# EAGLE schematic RobotArm (EAGLE 9.1.1)
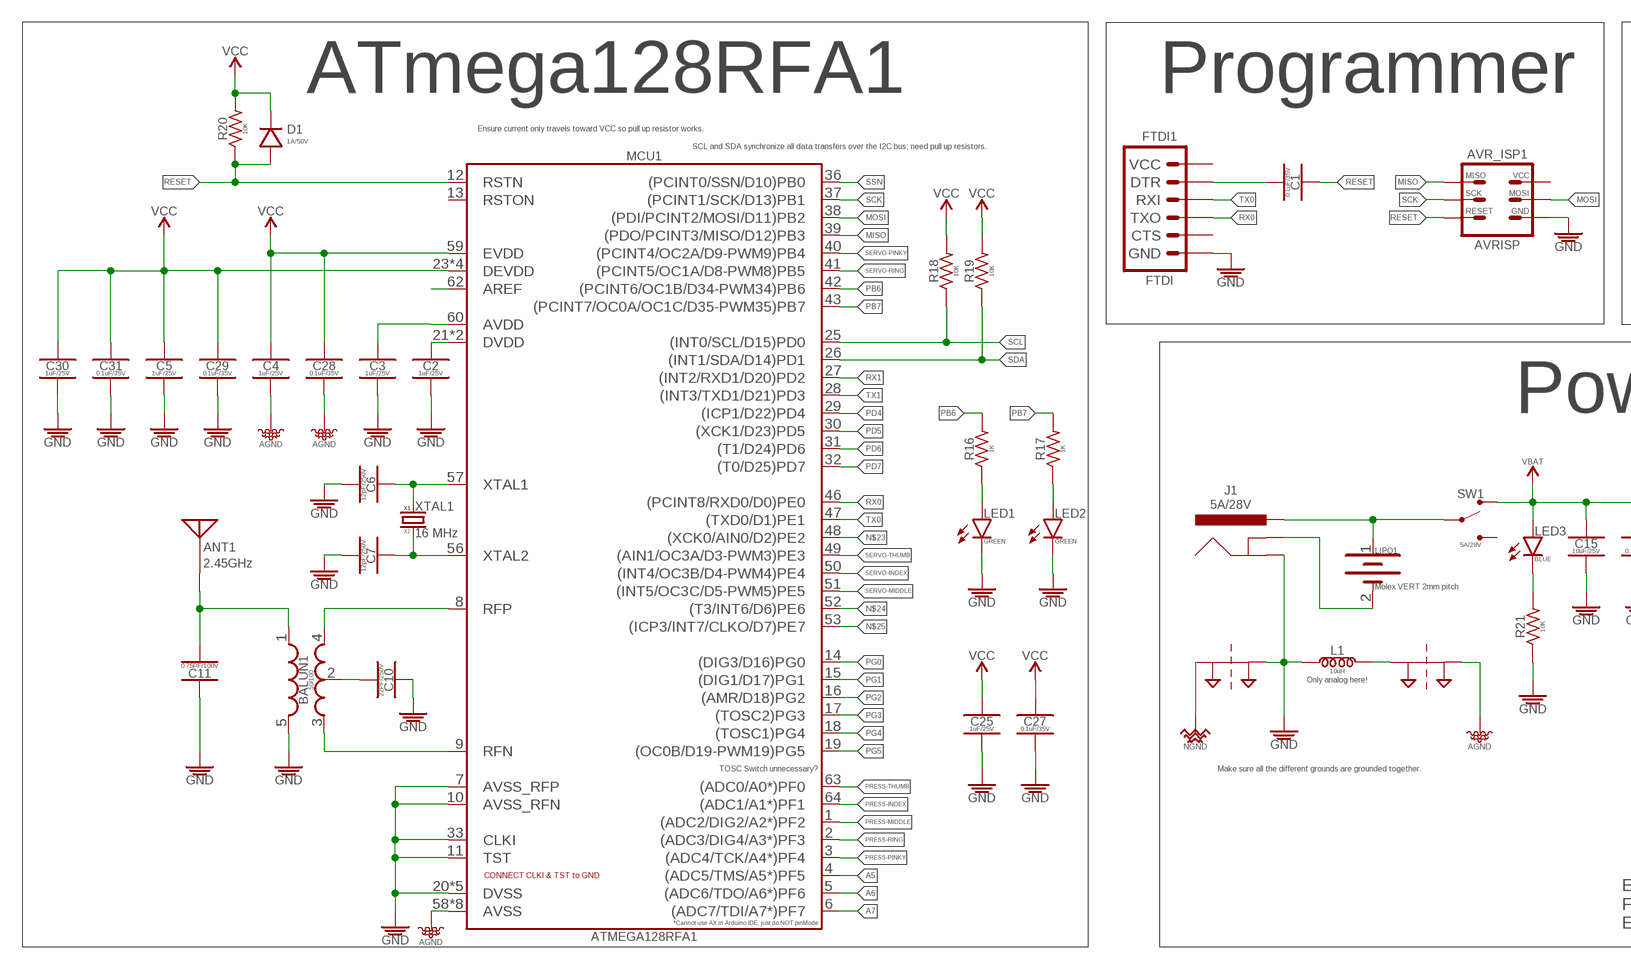
[diagram p0: schematic, sheet 1, part 1 of 2]
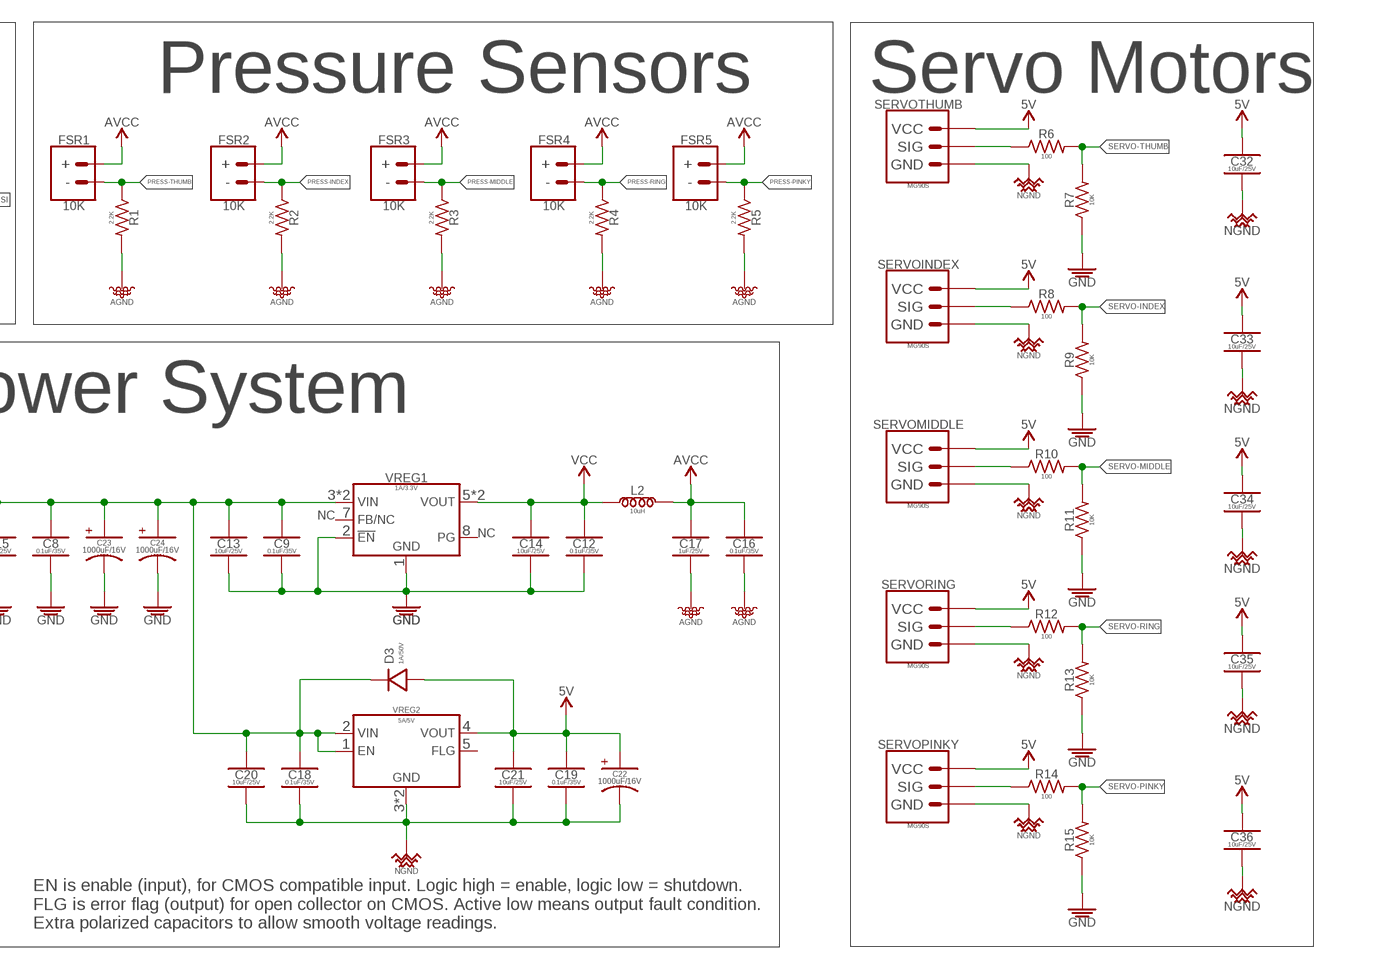
[diagram p1: schematic, sheet 1, part 2 of 2]

## Parts
ANT1  2.45GHz  ANTENNA_SMD_CHP-2.45GHZ-0.5DBI-3W  [ANTC6522X100]
AVR_ISP1  AVRISP  AVR_SPI_PRG_6_PTH_VERT-MALE  [2X3-NS]
BALUN1  50/100  BALUN_SMD-0805_UNBAL/BAL-50/100  [RESCAXE65P200X125X95-6]
C1  0.1uF/35V  0.1UF_SMD-0805_35V-10%  [CAPC2012X95_SMD-0805]
C2  1uF/25V  1UF_CER_SMD-0805_25V-10%  [CAPC2012X95_SMD-0805]
C3  1uF/25V  1UF_CER_SMD-0805_25V-10%  [CAPC2012X95_SMD-0805]
C4  1uF/25V  1UF_CER_SMD-0805_25V-10%  [CAPC2012X95_SMD-0805]
C5  1uF/25V  1UF_CER_SMD-0805_25V-10%  [CAPC2012X95_SMD-0805]
C6  12pF/250V  12PF_SMD-0805_250V-5%  [CAPC2012X95_SMD-0805]
C7  12pF/250V  12PF_SMD-0805_250V-5%  [CAPC2012X95_SMD-0805]
C8  0.1uF/35V  0.1UF_SMD-0805_35V-10%  [CAPC2012X95_SMD-0805]
C9  0.1uF/35V  0.1UF_SMD-0805_35V-10%  [CAPC2012X95_SMD-0805]
C10  22PF/250V  22PF_SMD-805_250V-5%  [_CER_SMD-805]
C11  0.75PF/100V  0.75PF_SMD-805_100V-33%  [_CER_SMD-805]
C12  0.1uF/35V  0.1UF_SMD-0805_35V-10%  [CAPC2012X95_SMD-0805]
C13  10uF/25V  10UF_CER_SMD-0805_25V-10%  [CAPC2012X95_SMD-0805]
C14  10uF/25V  10UF_CER_SMD-0805_25V-10%  [CAPC2012X95_SMD-0805]
C15  10uF/25V  10UF_CER_SMD-0805_25V-10%  [CAPC2012X95_SMD-0805]
C16  0.1uF/35V  0.1UF_SMD-0805_35V-10%  [CAPC2012X95_SMD-0805]
C17  1uF/25V  1UF_CER_SMD-0805_25V-10%  [CAPC2012X95_SMD-0805]
C18  0.1uF/35V  0.1UF_SMD-0805_35V-10%  [CAPC2012X95_SMD-0805]
C19  0.1uF/35V  0.1UF_SMD-0805_35V-10%  [CAPC2012X95_SMD-0805]
C20  10uF/25V  10UF_CER_SMD-0805_25V-10%  [CAPC2012X95_SMD-0805]
C21  10uF/25V  10UF_CER_SMD-0805_25V-10%  [CAPC2012X95_SMD-0805]
C22  1000uF/16V  1000UF-POLARIZED_PTH_16V-20%  [_AE_PTH_DIA8-LS3.5-H21.50]
C23  1000uF/16V  1000UF-POLARIZED_PTH_16V-20%  [_AE_PTH_DIA8-LS3.5-H21.50]
C24  1000uF/16V  1000UF-POLARIZED_PTH_16V-20%  [_AE_PTH_DIA8-LS3.5-H21.50]
C25  1uF/25V  1UF_CER_SMD-0805_25V-10%  [CAPC2012X95_SMD-0805]
C27  0.1uF/35V  0.1UF_SMD-0805_35V-10%  [CAPC2012X95_SMD-0805]
C28  0.1uF/35V  0.1UF_SMD-0805_35V-10%  [CAPC2012X95_SMD-0805]
C29  0.1uF/35V  0.1UF_SMD-0805_35V-10%  [CAPC2012X95_SMD-0805]
C30  1uF/25V  1UF_CER_SMD-0805_25V-10%  [CAPC2012X95_SMD-0805]
C31  0.1uF/35V  0.1UF_SMD-0805_35V-10%  [CAPC2012X95_SMD-0805]
C32  10uF/25V  10UF_CER_SMD-0805_25V-10%  [CAPC2012X95_SMD-0805]
C33  10uF/25V  10UF_CER_SMD-0805_25V-10%  [CAPC2012X95_SMD-0805]
C34  10uF/25V  10UF_CER_SMD-0805_25V-10%  [CAPC2012X95_SMD-0805]
C35  10uF/25V  10UF_CER_SMD-0805_25V-10%  [CAPC2012X95_SMD-0805]
C36  10uF/25V  10UF_CER_SMD-0805_25V-10%  [CAPC2012X95_SMD-0805]
D1  1A/50V  DIODE_GENERAL-PURPOSE_SMD_GP_1A-50V  [SODFL3516X170]
D3  1A/50V  DIODE_GENERAL-PURPOSE_SMD_GP_1A-50V  [SODFL3516X170]
FSR1  10K  FORCE-SENSITIVE-RESISTOR_SENSOR_FSR-5MM_0530470210_VERT-MALE_PITCH-1.25MM  [_MOLEX-0530470210_VERT_PITCH-1.25MM]
FSR2  10K  FORCE-SENSITIVE-RESISTOR_SENSOR_FSR-5MM_0530470210_VERT-MALE_PITCH-1.25MM  [_MOLEX-0530470210_VERT_PITCH-1.25MM]
FSR3  10K  FORCE-SENSITIVE-RESISTOR_SENSOR_FSR-5MM_0530470210_VERT-MALE_PITCH-1.25MM  [_MOLEX-0530470210_VERT_PITCH-1.25MM]
FSR4  10K  FORCE-SENSITIVE-RESISTOR_SENSOR_FSR-5MM_0530470210_VERT-MALE_PITCH-1.25MM  [_MOLEX-0530470210_VERT_PITCH-1.25MM]
FSR5  10K  FORCE-SENSITIVE-RESISTOR_SENSOR_FSR-5MM_0530470210_VERT-MALE_PITCH-1.25MM  [_MOLEX-0530470210_VERT_PITCH-1.25MM]
FTDI1  FTDI  FTDI_PTH_RA-MALE  [FTDI_BASIC-6PIN-MALE-RA]
J1  5A/28V  POWER_JACK-BARREL_ID2.1MM-OD5.5MM_PTH_ID2.1MM-OD5.5MM  [POWER_JACK_PTH_ID2.1MM-OD5.5MM]
L1  10uH  10UH_SMD-805_0.5A-0.65OHM-10%  [_SMD-805]
L2  10uH  10UH_SMD-805_0.5A-0.65OHM-10%  [_SMD-805]
LED1  GREEN  LED_SMD-0805_DISCRETE_GREEN_  [LEDC2012X120_LED-0805]
LED2  GREEN  LED_SMD-0805_DISCRETE_GREEN_  [LEDC2012X120_LED-0805]
LED3  BLUE  LED_SMD-0805_DISCRETE_BLUE  [LEDC2012X120_LED-0805]
LIPO1  Molex VERT 2mm pitch  1X02_MOLEX_89400_VERT-MALE_PITCH-2MM  [_MOLEX-89400_VERT_PITCH-2MM]
MCU1  ATMEGA128RFA1  ATMEGA128RFA1_VFQFN-64_EXPOSED-PAD  [QFN50P900X900X90-64]
NET_BRIDGE1  2PT_GND_TIE  [2PT_GND_TIE]
NET_BRIDGE2  2PT_GND_TIE  [2PT_GND_TIE]
R1  2.2K  2.2KΩ_SMD-0805_1/8W-5%  [RESC2012X60_SMD-0805]
R2  2.2K  2.2KΩ_SMD-0805_1/8W-5%  [RESC2012X60_SMD-0805]
R3  2.2K  2.2KΩ_SMD-0805_1/8W-5%  [RESC2012X60_SMD-0805]
R4  2.2K  2.2KΩ_SMD-0805_1/8W-5%  [RESC2012X60_SMD-0805]
R5  2.2K  2.2KΩ_SMD-0805_1/8W-5%  [RESC2012X60_SMD-0805]
R6  100  100Ω_SMD-0805_1/8W-5%  [RESC2012X60_SMD-0805]
R7  10K  10KΩ_SMD-0805_1/8W-5%  [RESC2012X60_SMD-0805]
R8  100  100Ω_SMD-0805_1/8W-5%  [RESC2012X60_SMD-0805]
R9  10K  10KΩ_SMD-0805_1/8W-5%  [RESC2012X60_SMD-0805]
R10  100  100Ω_SMD-0805_1/8W-5%  [RESC2012X60_SMD-0805]
R11  10K  10KΩ_SMD-0805_1/8W-5%  [RESC2012X60_SMD-0805]
R12  100  100Ω_SMD-0805_1/8W-5%  [RESC2012X60_SMD-0805]
R13  10K  10KΩ_SMD-0805_1/8W-5%  [RESC2012X60_SMD-0805]
R14  100  100Ω_SMD-0805_1/8W-5%  [RESC2012X60_SMD-0805]
R15  10K  10KΩ_SMD-0805_1/8W-5%  [RESC2012X60_SMD-0805]
R16  1K  1KΩ_SMD-0805_1/8W-5%  [RESC2012X60_SMD-0805]
R17  1K  1KΩ_SMD-0805_1/8W-5%  [RESC2012X60_SMD-0805]
R18  10K  10KΩ_SMD-0805_1/8W-5%  [RESC2012X60_SMD-0805]
R19  10K  10KΩ_SMD-0805_1/8W-5%  [RESC2012X60_SMD-0805]
R20  10K  10KΩ_SMD-0805_1/8W-5%  [RESC2012X60_SMD-0805]
R21  10K  10KΩ_SMD-0805_1/8W-5%  [RESC2012X60_SMD-0805]
SERVOINDEX  MG90S  SERVO_MG90S_1X03_VERT_MALE  [1X03-VERT-MALE]
SERVOMIDDLE  MG90S  SERVO_MG90S_1X03_VERT_MALE  [1X03-VERT-MALE]
SERVOPINKY  MG90S  SERVO_MG90S_1X03_VERT_MALE  [1X03-VERT-MALE]
SERVORING  MG90S  SERVO_MG90S_1X03_VERT_MALE  [1X03-VERT-MALE]
SERVOTHUMB  MG90S  SERVO_MG90S_1X03_VERT_MALE  [1X03-VERT-MALE]
SW1  5A/28V  SWITCH_SPDT_VERT_PTH_5A-28V_13L-7W_  [SW_TOGGLE_SPDT_5A-28V_13L-7W]
VREG1  1A/3.3V  VREG_TPS768XX_ULDO_FAST-TRANSIENT_TPS76833QDR_1A-3.3V  [SOIC127P600X265-8]
VREG2  5A/5V  VREG_MIC29501-5.0_LINEAR_ULDO_5A-5V_MC29501-5.0_5A-5V  [TO170P1363X457-6]
XTAL1  16 MHz  CRYSTAL_ABM3B_16MHZ_18PF  [OSCCC500X320X110]

## Nets
5V: C19.1 C21.1 C22.+(A) C32.1 C33.1 C34.1 C35.1 C36.1 D3.A SERVOINDEX.VCC SERVOMIDDLE.VCC SERVOPINKY.VCC SERVORING.VCC SERVOTHUMB.VCC VREG2.4(VOUT)
+: J1.PWR LIPO1.1(+) SW1.P
-: J1.GND@1(GND) LIPO1.2(-)
A5: MCU1.4((ADC5/TMS/A5*)PF5)
A6: MCU1.5((ADC6/TDO/A6*)PF6)
A7: MCU1.6((ADC7/TDI/A7*)PF7)
AGND: C4.2 C16.2 C17.2 C28.2 MCU1.58(AVSS) MCU1.61(AVSS) MCU1.EP(AVSS) MCU1.P$1(AVSS) MCU1.P$2(AVSS) MCU1.P$3(AVSS) MCU1.P$4(AVSS) MCU1.P$5(AVSS) NET_BRIDGE2.P$2 R1.2 R2.2 R3.2 R4.2 R5.2
AVCC: C16.1 C17.1 L2.2
GND: AVR_ISP1.GND BALUN1.5(GND) C2.2 C3.2 C5.2 C6.2 C7.2 C8.2 C9.2 C10.1 C11.1 C12.2 C13.2 C14.2 C15.2 C23.-(K) C24.-(K) C25.2 C27.2 C29.2 C30.2 C31.2 FTDI1.GND J1.GND@2(GND) L1.1 LED1.K LED2.K MCU1.7(AVSS_RFP) MCU1.10(AVSS_RFN) MCU1.11(TST) MCU1.20(DVSS) MCU1.24(DVSS) MCU1.33(CLKI) MCU1.35(DVSS) MCU1.45(DVSS) MCU1.55(DVSS) NET_BRIDGE1.P$2 R7.1 R9.1 R11.1 R13.1 R15.1 R21.1 VREG1.1(GND) VREG1.2(!EN)
MISO: AVR_ISP1.MISO MCU1.39((PDO/PCINT3/MISO/D12)PB3)
MOSI: AVR_ISP1.MOSI MCU1.38((PDI/PCINT2/MOSI/D11)PB2)
N$1: R6.1 SERVOTHUMB.SIG
N$2: LED1.A R16.1
N$3: R8.1 SERVOINDEX.SIG
N$4: R10.1 SERVOMIDDLE.SIG
N$5: R12.1 SERVORING.SIG
N$6: R14.1 SERVOPINKY.SIG
N$7: LED2.A R17.1
N$8: C6.1 MCU1.57(XTAL1) XTAL1.1(XTAL1)
N$9: C7.1 MCU1.56(XTAL2) XTAL1.3(XTAL2)
N$10: C1.2 FTDI1.DTR
N$11: BALUN1.4(OUT2) MCU1.8(RFP)
N$12: BALUN1.3(OUT1) MCU1.9(RFN)
N$13: MCU1.62(AREF)
N$14: C3.1 MCU1.60(AVDD)
N$15: C2.1 MCU1.21(DVDD) MCU1.22(DVDD)
N$16: BALUN1.2(GND) C10.2
N$17: ANT1.1(SIGNAL) BALUN1.1(IN) C11.2
N$19: L1.2 NET_BRIDGE2.P$1
N$20: LED3.K R21.2
N$23: MCU1.48((XCK0/AIN0/D2)PE2)
N$24: MCU1.52((T3/INT6/D6)PE6)
N$25: MCU1.53((ICP3/INT7/CLKO/D7)PE7)
NGND: C18.2 C19.2 C20.2 C21.2 C22.-(K) C32.2 C33.2 C34.2 C35.2 C36.2 NET_BRIDGE1.P$1 SERVOINDEX.GND SERVOMIDDLE.GND SERVOPINKY.GND SERVORING.GND SERVOTHUMB.GND VREG2.3(GND) VREG2.6(GND)
PB6: MCU1.42((PCINT6/OC1B/D34-PWM34)PB6) R16.2
PB7: MCU1.43((PCINT7/OC0A/OC1C/D35-PWM35)PB7) R17.2
PD4: MCU1.29((ICP1/D22)PD4)
PD5: MCU1.30((XCK1/D23)PD5)
PD6: MCU1.31((T1/D24)PD6)
PD7: MCU1.32((T0/D25)PD7)
PG0: MCU1.14((DIG3/D16)PG0)
PG1: MCU1.15((DIG1/D17)PG1)
PG2: MCU1.16((AMR/D18)PG2)
PG3: MCU1.17((TOSC2)PG3)
PG4: MCU1.18((TOSC1)PG4)
PG5: MCU1.19((OC0B/D19-PWM19)PG5)
PRESS-INDEX: FSR2.2(-) MCU1.64((ADC1/A1*)PF1) R2.1
PRESS-MIDDLE: FSR3.2(-) MCU1.1((ADC2/DIG2/A2*)PF2) R3.1
PRESS-PINKY: FSR5.2(-) MCU1.3((ADC4/TCK/A4*)PF4) R5.1
PRESS-RING: FSR4.2(-) MCU1.2((ADC3/DIG4/A3*)PF3) R4.1
PRESS-THUMB: FSR1.2(-) MCU1.63((ADC0/A0*)PF0) R1.1
RESET: AVR_ISP1.RESET C1.1 D1.A MCU1.12(RSTN) R20.1
RX0: FTDI1.TXO MCU1.46((PCINT8/RXD0/D0)PE0)
RX1: MCU1.27((INT2/RXD1/D20)PD2)
SCK: AVR_ISP1.SCK MCU1.37((PCINT1/SCK/D13)PB1)
SCL: MCU1.25((INT0/SCL/D15)PD0) R18.1
SDA: MCU1.26((INT1/SDA/D14)PD1) R19.1
SERVO-INDEX: MCU1.50((INT4/OC3B/D4-PWM4)PE4) R8.2 R9.2
SERVO-MIDDLE: MCU1.51((INT5/OC3C/D5-PWM5)PE5) R10.2 R11.2
SERVO-PINKY: MCU1.40((PCINT4/OC2A/D9-PWM9)PB4) R14.2 R15.2
SERVO-RING: MCU1.41((PCINT5/OC1A/D8-PWM8)PB5) R12.2 R13.2
SERVO-THUMB: MCU1.49((AIN1/OC3A/D3-PWM3)PE3) R6.2 R7.2
SSN: MCU1.36((PCINT0/SSN/D10)PB0)
TX0: FTDI1.RXI MCU1.47((TXD0/D1)PE1)
TX1: MCU1.28((INT3/TXD1/D21)PD3)
VBAT: C8.1 C9.1 C13.1 C15.1 C18.1 C20.1 C23.+(A) C24.+(A) D3.K LED3.A SW1.S1 VREG1.3(VIN) VREG1.4(VIN) VREG2.1(EN) VREG2.2(VIN)
VCC: C4.1 C5.1 C12.1 C14.1 C25.1 C27.1 C28.1 C29.1 C30.1 C31.1 D1.K FSR1.1(+) FSR2.1(+) FSR3.1(+) FSR4.1(+) FSR5.1(+) L2.1 MCU1.23(DEVDD) MCU1.34(DEVDD) MCU1.44(DEVDD) MCU1.54(DEVDD) MCU1.59(EVDD) R18.2 R19.2 R20.2 VREG1.5(VOUT) VREG1.6(VOUT) ; supply symbol labelled AVCC
Unconnected: AVR_ISP1.VCC FTDI1.CTS FTDI1.VCC MCU1.13(RSTON) SW1.S2 VREG1.7(FB/NC) VREG1.8(PG) VREG2.5(FLG)

## Notes on the sheet
- ATmega128RFA1 | Programmer | Pressure Sensors | Servo Motors
- Ensure current only travels toward VCC so pull up resistor works.
- SCL and SDA synchronize all data transfers over the I2C bus; need pull up resistors.
- Power System
- Only analog here!
- TOSC Switch unnecessary? | Make sure all the different grounds are grounded together.
- EN is enable (input), for CMOS compatible input. Logic high = enable, logic low = shutdown. 
  FLG is error flag (output) for open collector on CMOS. Active low means output fault condition.
  Extra polarized capacitors to allow smooth voltage readings.

## Library data of the parts
ANT1 = PiB_radio_frequency:ANTENNA: Chip antenna Single endded antenna. Common with smaller chip antennas. CHIP4 package is the GPS Chip Antenna SKU: GPS-08418. CHIP5 package is 2.4GHz chip antenna SKU: WRL-00144.; DATASHEET: https://linxtechnologies.com/wp/wp-content/uploads/ant-fff-chp-x.pdf; DIST: Digikey; DISTLINK: https://www.digikey.com/products/en?keywords=ANT-2.45-CHPCT-ND; DISTPN: ANT-2.45-CHPCT-ND; MFR: Linx Technologies Inc.; MPN: ANT-2.45-CHP-T
AVR_ISP1 = PiB_connectors:AVR_SPI_PRG_6: AVR ISP 6 Pin This is the reduced ISP connector for AVR programming. Common on Arduino. This footprint will take up less PCB space and can be used with a 10-pin to 6-pin adapter such as SKU: BOB-08508; DATASHEET: https://cdn.amphenol-icc.com/media/wysiwyg/files/drawing/67996.pdf; DIST: Digikey; DISTLINK: https://www.digikey.com/products/en?keywords=609-3234-ND; DISTPN: 609-3234-ND; MFR: Amphenol FCI; MPN: 67997-206HLF
BALUN1 = PiB_radio_frequency:BALUN: 0805 footprint balun- Ember 351/357; DATASHEET: http://katalog.we-online.de/pbs/datasheet/748421245.pdf; DIST: Digikey; DISTLINK: https://www.digikey.com/products/en?keywords=732-2230-6-ND; DISTPN: 732-2230-6-ND; MFR: Wurth Electronics Inc.; MPN: 748421245
C1 C8 C9 C12 C16 C18 C19 C27-C29 C31 = PiB_capacitors:0.1UF; DATASHEET: http://ds.yuden.co.jp/TYCOMPAS/ut/detail.do?productNo=GMK212BJ104KGHT&fileName=GMK212BJ104KGHT_SS&mode=specSheetDownload; DIST: Digikey; DISTLINK: https://www.digikey.com/products/en?keywords=587-3364-1-ND; DISTPN: 587-3364-1-ND; MFR: Taiyo Yuden; MPN: GMK212BJ104KGHT
C2-C5 C17 C25 C30 = PiB_capacitors:1UF; DATASHEET: https://search.murata.co.jp/Ceramy/image/img/A01X/G101/ENG/GRM216R61E105KA12-01.pdf; DIST: Digikey; DISTLINK: https://www.digikey.com/products/en?keywords=490-1700-1-ND; DISTPN: 490-1700-1-ND; MFR: Murata Electronics North America; MPN: GRM216R61E105KA12D
C6 C7 = PiB_capacitors:12PF; DATASHEET: http://search.murata.co.jp/Ceramy/image/img/A01X/G101/ENG/GRM21A5C2E120JW01-01.pdf; DIST: Digikey; DISTLINK: https://www.digikey.com/products/en?keywords=490-5531-1-ND; DISTPN: 490-5531-1-ND; MFR: Murata Electronics North America; MPN: GRM21A5C2E120JW01D
C10 = PiB_capacitors:22PF; CREATOR: Kenmei; DATASHEET: http://search.murata.co.jp/Ceramy/image/img/A01X/G101/ENG/GRM21A5C2E220JW01-01.pdf; DIST: Digikey; DISTLINK: https://www.digikey.com/product-detail/en/murata-electronics-north-america/GRM21A5C2E220JW01D/490-5534-1-ND/2334930; DISTPN: 490-5534-1-ND; MFR: Murata Electronics North America; MPN: GRM21A5C2E220JW01D; TESTED: NO
C11 = PiB_capacitors:0.75PF; CREATOR: Kenmei; DATASHEET: http://search.murata.co.jp/Ceramy/image/img/A01X/G101/ENG/GQM2195C2AR75CB01-01.pdf; DIST: Digikey; DISTLINK: https://www.digikey.com/product-detail/en/murata-electronics-north-america/GQM2195C2AR75CB01D/490-3585-1-ND/789585; DISTPN: 490-3585-1-ND; MFR: Murata Electronics North America; MPN: GQM2195C2AR75CB01D; TESTED: NO
C13-C15 C20 C21 C32-C36 = PiB_capacitors:10UF; DATASHEET: https://www.yuden.co.jp/productdata/catalog/mlcc_all_e.pdf; DIST: Digikey; DISTLINK: https://www.digikey.com/products/en?keywords=587-2985-1-ND; DISTPN: 587-2985-1-ND; MFR: Taiyo Yuden; MPN: TMK212BBJ106KG-T
C22-C24 = PiB_capacitors:1000UF-POLARIZED; DATASHEET: http://www.chemi-con.co.jp/cgi-bin/CAT_DB/SEARCH/cat_db_al.cgi?e=e&j=p&pdfname=kzm; DIST: Digikey; DISTLINK: https://www.digikey.com/products/en?keywords=565-3567-ND; DISTPN: 565-3567-ND; MFR: United Chemi-Con; MPN: EKZM160ELL102MH20D
D1 D3 = PiB_discrete_semiconductors:DIODE_GENERAL-PURPOSE; DATASHEET: http://www.comchiptech.com/cms/UserFiles/CGRKM4001-HF%20Thru.%20CGRKM4007-HF%20RevG.pdf; DIST: Digikey; DISTLINK: https://www.digikey.com/products/en?keywords=641-1511-1-ND; DISTPN: 641-1511-1-ND; MFR: Comchip Technology; MPN: CGRKM4001-HF
FSR1-FSR5 = PiB_sensors:FORCE-SENSITIVE-RESISTOR_SENSOR; DATASHEET: https://cdn2.hubspot.net/hubfs/3899023/Interlinkelectronics%20November2017/Docs/Datasheet_FSR.pdf; DATASHEET_CONNECTOR1: https://www.molex.com/pdm_docs/sd/530470210_sd.pdf; DATASHEET_CONNECTOR2: https://www.molex.com/pdm_docs/sd/510210700_sd.pdf; DATASHEET_CRIMP: https://www.molex.com/pdm_docs/sd/500798000_sd.pdf; DIST: Digikey; DISTLINK: https://www.digikey.com/products/en?keywords=1027-1014-ND; DISTLINK_CONNECTOR1: https://www.digikey.com/products/en?keywords=WM1731-ND; DISTLINK_CONNECTOR2: https://www.digikey.com/products/en?keywords=WM1720-ND; DISTLINK_CRIMP: https://www.digikey.com/products/en?keywords=WM1142CT-ND; DISTPN: 1027-1014-ND; DISTPN_CONNECTOR1: WM1731-ND; DISTPN_CONNECTOR2: WM1720-ND; DISTPN_CRIMP: WM1142CT-ND; DIST_CONNECTOR1: Digikey; DIST_CONNECTOR2: Digikey; DIST_CRIMP: Digikey; MFR: Spectra Symbol; MFR_CONNECTOR1: Molex, LLC; MFR_CONNECTOR2: Molex, LLC; MFR_CRIMP: Molex, LLC; MPN: FS-L-0095-103-ST; MPN_CONNECTOR1: 0530470210; MPN_CONNECTOR2: 51021-0200; MPN_CRIMP: 0500798000
FTDI1 = PiB_connectors:FTDI: FTDI Basic header with labels; DATASHEET: https://media.digikey.com/pdf/Data%20Sheets/Sparkfun%20PDFs/DEV-09873_Web.pdf; DATASHEET_CONNECTOR: https://cdn.amphenol-icc.com/media/wysiwyg/files/drawing/68015.pdf; DIST: Digikey; DISTLINK: https://www.digikey.com/products/en?keywords=1568-1104-ND; DISTLINK_CONNECTOR: https://www.digikey.com/products/en?keywords=609-3327-ND; DISTPN: 1568-1104-ND; DISTPN_CONNECTOR: 609-3327-ND; DIST_CONNECTOR: Digikey; MFR: SparkFun Electronics; MFR_CONNECTOR: Amphenol FCI; MPN: DEV-09873; MPN_CONNECTOR: 68016-406HLF
J1 = PiB_connectors:POWER_JACK-BARREL_ID2.1MM-OD5.5MM; DATASHEET: https://www.cui.com/product/resource/pj-102a.pdf; DIST: Digikey; DISTLINK: https://www.digikey.com/products/en?keywords=CP-102A-ND; DISTPN: CP-102A-ND; MFR: CUI Inc.; MPN: PJ-102A
L1 L2 = PiB_inductors:10UH; CREATOR: MrSwirlyEyes; DATASHEET: http://ds.yuden.co.jp/TYCOMPAS/ut/detail.do?productNo=CB2012T100KR&fileName=CB2012T100KR_SS&mode=specSheetDownload; DIST: Digikey; DISTLINK: https://www.digikey.com/products/en?keywords=587-2452-1-ND; DISTPN: 587-2452-1-ND; MFR: Taiyo Yuden; MPN: CB2012T100KR
LED1 LED2 = PiB_leds:LED; DATASHEET: http://optoelectronics.liteon.com/upload/download/DS22-2000-073/LTST-C170KGKT.pdf; DIST: Digikey; DISTLINK: https://www.digikey.com/products/en?keywords=160-1414-1-ND; DISTPN: 160-1414-1-ND; MFR: Lite-On Inc.; MPN: LTST-C170KGKT
LED3 = PiB_leds:LED; DATASHEET: http://optoelectronics.liteon.com/upload/download/DS-22-99-0226/LTST-C170TBKT.pdf; DIST: Digikey; DISTLINK: https://www.digikey.com/products/en?keywords=160-1579-1-ND; DISTPN: 160-1579-1-ND; MFR: Lite-On Inc.; MPN: LTST-C170TBKT
LIPO1 = PiB_connectors:1X02_MOLEX; DATASHEET_CONNECTOR1: https://www.molex.com/pdm_docs/sd/894000220_sd.pdf; DATASHEET_CONNECTOR2: https://www.molex.com/pdm_docs/sd/873690200_sd.pdf; DATASHEET_CRIMP: https://www.molex.com/pdm_docs/sd/502128000_sd.pdf; DISTLINK_CONNECTOR1: https://www.digikey.com/products/en?keywords=WM4340-ND; DISTLINK_CONNECTOR2: https://www.digikey.com/products/en?keywords=WM10118-ND; DISTLINK_CRIMP: https://www.digikey.com/products/en?keywords=WM4561CT-ND; DISTPN_CONNECTOR1: WM4340-ND; DISTPN_CONNECTOR2: WM10118-ND; DISTPN_CRIMP: WM4561CT-ND; DIST_CONNECTOR1: Digikey; DIST_CONNECTOR2: Digikey; DIST_CRIMP: Digikey; MFR_CONNECTOR1: Molex, LLC; MFR_CONNECTOR2: Molex, LLC; MFR_CRIMP: Molex, LLC; MPN_CONNECTOR1: 0894000220; MPN_CONNECTOR2: 0873690200; MPN_CRIMP: 50212-8000
MCU1 = PiB_ic_microcontrollers:ATMEGA128RFA1: ATmega128RFA1 8-bit AVR Microcontroller with Low Power 2.4GHz Transceiver for ZigBee and IEEE 802.15.4; DATASHEET: http://www.microchip.com/mymicrochip/filehandler.aspx?ddocname=en590262; DIST: Digikey; DISTLINK: https://www.digikey.com/products/en?keywords=ATMEGA128RFA1-ZU-ND; DISTPN: ATMEGA128RFA1-ZU-ND; MFR: Microchip Technology; MPN: ATMEGA128RFA1-ZU
NET_BRIDGE1 NET_BRIDGE2 = PiB_power_symbols:2PT_GND_TIE
R1-R5 = PiB_resistors:2.2KΩ; DATASHEET: http://www.yageo.com/NewPortal/yageodocoutput?fileName=/pdf/R-Chip/PYu-RC_51_RoHS_P_0.pdf; DIST: Digikey; DISTLINK: https://www.digikey.com/products/en?keywords=YAG1332CT-ND; DISTPN: YAG1332CT-ND; MFR: Yageo; MPN: RC0805JR-072K2P
R6 R8 R10 R12 R14 = PiB_resistors:100Ω; DATASHEET: http://www.yageo.com/NewPortal/yageodocoutput?fileName=/pdf/R-Chip/PYu-AC_51_RoHS_L_6.pdf; DIST: Digikey; DISTLINK: https://www.digikey.com/products/en?keywords=YAG3757CT-ND; DISTPN: YAG3757CT-ND; MFR: Yageo; MPN: AC0805JR-07100RL
R7 R9 R11 R13 R15 R18-R21 = PiB_resistors:10KΩ; DATASHEET: http://www.yageo.com/documents/recent/PYu-RC_Group_51_RoHS_L_9.pdf; DIST: Digikey; DISTLINK: https://www.digikey.com/products/en?keywords=311-10KARCT-ND; DISTPN: 311-10KARCT-ND; MFR: Yageo; MPN: RC0805JR-0710KL
R16 R17 = PiB_resistors:1KΩ; DATASHEET: http://www.yageo.com/documents/recent/PYu-RC_Group_51_RoHS_L_9.pdf; DIST: Digikey; DISTLINK: https://www.digikey.com/products/en?keywords=311-1.0KARCT-ND; DISTPN: 311-1.0KARCT-ND; MFR: Yageo; MPN: RC0805JR-071KL
SERVOINDEX SERVOMIDDLE SERVOPINKY SERVORING SERVOTHUMB = PiB:SERVO
SW1 = PiB_switches:SWITCH_SPDT; DATASHEET: http://spec_sheets.e-switch.com/specs/T111597.pdf; DIST: Digikey; DISTLINK: https://www.digikey.com/products/en?keywords=EG2355-ND; DISTPN: EG2355-ND; MFR: E-Switch; MPN: 100SP1T1B4M2QE
VREG1 = PiB_ic_power:VREG_TPS768XX_ULDO_FAST-TRANSIENT; DATASHEET: http://www.ti.com/lit/ds/symlink/tps768.pdf; DIST: Digikey; DISTLINK: https://www.digikey.com/products/en?keywords=296-46395-1-ND; DISTPN: 296-46395-1-ND; MFR: Texas Instruments; MPN: TPS76833QDR
VREG2 = PiB_ic_power:VREG_MIC29501-5.0_LINEAR_ULDO_5A-5V; DATASHEET: http://ww1.microchip.com/downloads/en/DeviceDoc/20005685A.pdf; DIST: Digikey; DISTLINK: https://www.digikey.com/products/en?keywords=576-2240-ND; DISTPN: 576-2240-ND; MFR: Microchip Technology; MPN: MIC29501-5.0WU
XTAL1 = PiB:CRYSTAL: Various standard crystals. Proven footprints.; DATASHEET: https://abracon.com/Resonators/abm3b.pdf; DIST: Digikey; DISTLINK: https://www.digikey.com/products/en?keywords=535-9122-1-ND; DISTPN: 535-9122-1-ND; MFR: Abracon LLC; MPN: ABM3B-16.000MHZ-B2-T